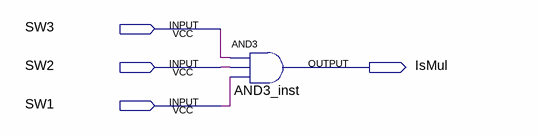
[diagram p0: schematic sheet]
// Quartus schematic contorol_IsMul.bdf as structural Verilog: 1 symbols, 4 pins
module contorol_IsMul (
  input  SW3,
  input  SW2,
  input  SW1,
  output IsMul
);

  and AND3_inst (IsMul, SW3, SW2, SW1);
endmodule
